# EAGLE board FA_IOTv4.2.1 (EAGLE 7.2.0)
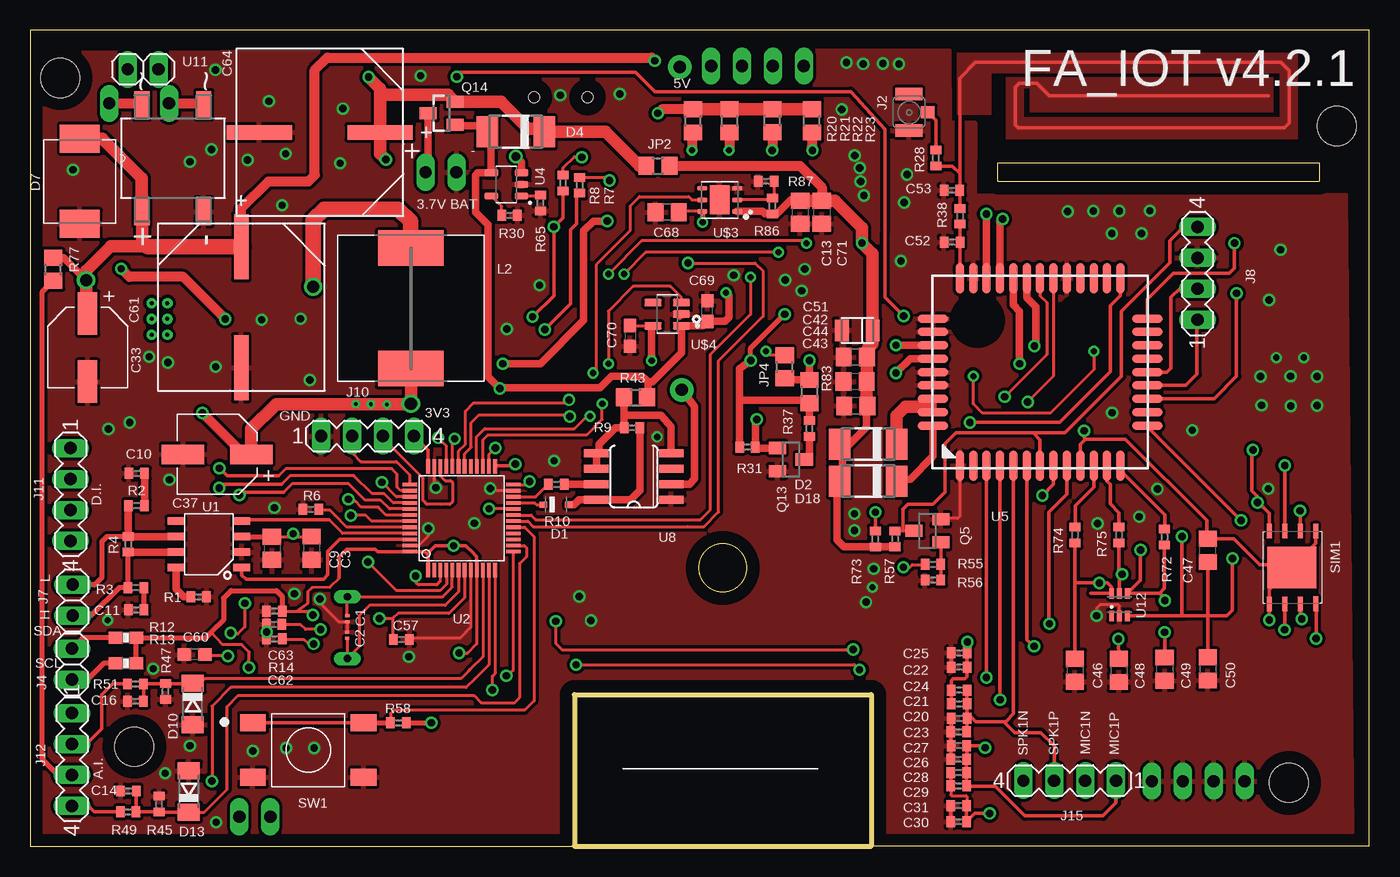
[diagram p6: board, top side]
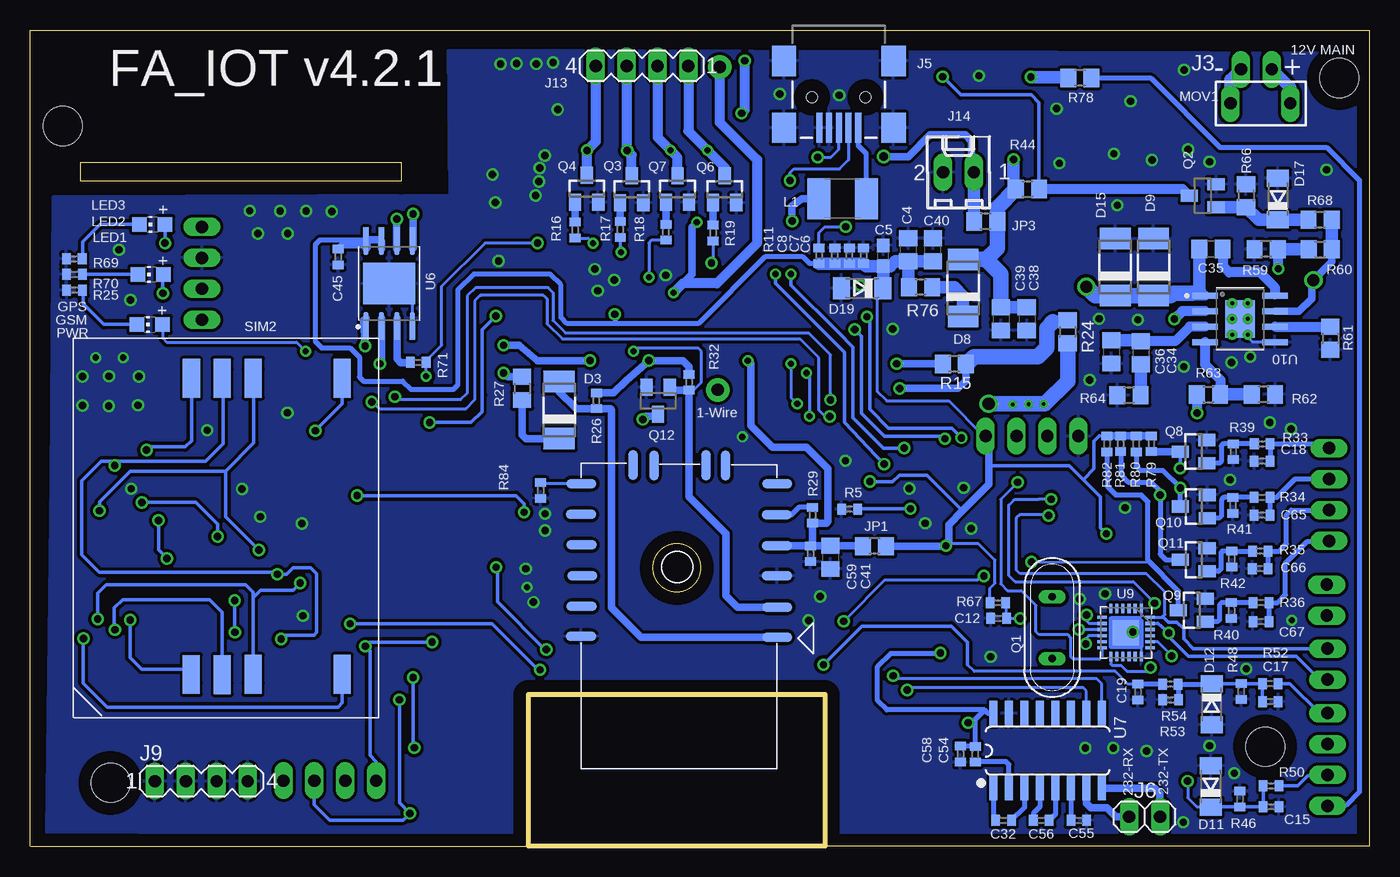
[diagram p7: board, bottom side, seen from below]

Size 110 x 67 mm. Coordinates in mm from the lower left corner, seen from the top.
Outline: 110,0 110,67 0,67 0,0 44.7,0
Outline: 44.7,0 69.09,0
Outline: 44.7,0 44.7,12.45 69.09,12.45 69.09,0
Outline: 109.98,0 69.09,0
Outline: 79.5,56.13 105.92,56.13 105.92,54.61 79.5,54.61 79.5,56.13
Outline: circle at 56.89,22.86 radius 1.96
Copper layers (1*16): Top 0.035mm / dielectric 1.5mm / Bottom 0.035mm
Design rules "default *": minimum track width 8mil, minimum drill 0.3mm, track to track 8mil, track to pad 8mil, pad to pad 8mil, via to via 8mil, smd to smd 8mil, copper to edge 40mil, drill to drill 8mil, minimum pad ring 10mil, minimum via ring 8mil, stop-mask expansion 4mil, vias tented up to drill 25mil, thermal gap 10mil
Net classes: 1 POWER: clearance 0.205 mm; 2 GND: clearance 0.205 mm; 3 CAN: width 0.254 mm, clearance 0.205 mm
Holes 3.2 mm at 107.35,59.15 103.41,5.19 2.45,63.09 8.54,8.17

## Footprints (pad centres in the part's own frame; a part is rotated, then mirrored left to right if it is on the bottom)
C0201 = smd 0.25 x 0.35: 1 -0.25,0; 2 0.25,0
C0805 = smd 1.3 x 1.5: 1 -0.95,0; 2 0.95,0
C0603 = smd 1.1 x 1: 1 -0.85,0; 2 0.85,0
C0402 = smd 0.7 x 0.9: 1 -0.65,0; 2 0.65,0
3.5X1.6X2.1(BXCXA) = smd 3.5 x 1.6: 1 2.8,0; 2 -2.8,0
TE-A-3216 = smd 1.143 x 1.778: + 1.27,0; - -1.27,0
SM_RADIAL_H13 = smd 5.359 x 1.194: 1 -4.966,0; 2 4.966,0
SOD2513X120N = smd 0.6 x 0.5: A 1.05,0; C -1.05,0
DO-214AC = smd 1.778 x 2.54: A 2.342,0; C -2.342,0
S1M_DO-214AC = smd 1.778 x 2.54: A 2.342,0; C -2.342,0
VARTVSP_SMC&SMD/DO-214AB = smd 2.3 x 3.3: 1 -3.5,0; 2 3.5,0
SOD80C = smd 1.4 x 1.8: A 1.7,0; C -1.7,0
FOOT = drill 1 pad 1.93: 1 0.02,-0.01
CON-U.FL = smd 1 x 2.2: GND@0 -1.5,0; GND@1 1.5,0 | smd 1 x 1.1: S 0,-1.55
1X02 = drill 1.016 long: 1 -1.27,0; 2 1.27,0
USB-MINIB = smd 2.5 x 0.5: D+ 2.5,0; D- 2.5,0.8; GND 2.5,-1.6; ID 2.5,-0.8; VBUS 2.5,1.6 | smd 2.5 x 2: S1 -3,4.5; S2 2.5,4.5; S3 -3,-4.5; S4 2.5,-4.5 | hole 0.9: 0,2.2; 0,-2.2
MA04-1 = drill 1.016 long: 1 -3.81,0; 2 -1.27,0; 3 1.27,0; 4 3.81,0
6410-02 = drill 1.016 long: 1 1.27,0; 2 -1.27,0
R0805 = smd 1.3 x 1.5: 1 -0.95,0; 2 0.95,0
L1812 = smd 1.9 x 3.4: 1 -1.95,0; 2 1.95,0
WE-PD_1260/1245/1280/1210 = smd 2.9 x 5.4: 1 -4.95,0; 2 4.95,0
CHIP-LED0805 = smd 1.2 x 1.2: A 0,-1.05; C 0,1.05
TMOV14R275E = drill 1.016 long: 1 -2.495,0.11; 2 2.43,0.107
QS = drill 0.61 long: 1 -2.54,0; 2 2.54,0
SOT23 = smd 1 x 1.4: 1 -0.95,-1.1; 2 0.95,-1.1; 3 0,1.1
SOT23-BEC = smd 1 x 1.4: B -0.95,-1.1; C 0,1.1; E 0.95,-1.1
SSOT-3 = smd 1 x 1.4: 1 -0.95,-1.1; 2 0.95,-1.1; 3 0,1.1
R0402 = smd 0.7 x 0.9: 1 -0.65,0; 2 0.65,0
0603-RES = smd 1.1 x 1: 1 -0.85,0; 2 0.85,0
MFF2DFN8 = smd 0.6 x 0.4: 1 -2.696,1.848; 2 -2.696,0.578; 3 -2.696,-0.692; 4 -2.696,-1.962; 5 2.684,-1.962; 6 2.684,-0.692; 7 2.684,0.578; 8 2.684,1.848 | smd 1.2 x 0.4: C 2.987,1.848; D 2.98,0.583; E 2.985,-0.686; F 2.974,-1.958; G -2.992,-1.957; H -2.998,-0.692; I -2.998,0.58; J -2.999,1.847 | smd 3.4 x 4: PAD 0,0
91228-3001 = smd 3.2 x 1.4: C 22.62,-0.006; D 22.623,-2.534; E 22.633,-5.089; F 22.637,-12.401; G -1.698,-12.398; H -1.706,-5.067; I -1.717,-2.547; J -1.711,0 | smd 2.3 x 1.4: C1 22.175,0; C2 22.175,-2.54; C3 22.175,-5.08; C4 22.175,-12.4; C5 -1.27,0; C6 -1.27,-2.54; C7 -1.27,-5.08; C8 -1.27,-12.4
SW_5-1437565-0 = smd 2.1 x 1.4: 1 -4.55,2.25; 2 4.55,2.25; 3 -4.55,-2.25; 4 4.55,-2.25
SOIC8-6.0 = smd 0.6 x 1.4: 1 -1.905,-2.7; 2 -0.635,-2.7; 3 0.635,-2.7; 4 1.905,-2.7; 5 1.905,2.7; 6 0.635,2.7; 7 -0.635,2.7; 8 -1.905,2.7
LQFP48 = smd 0.3 x 1.2: 1 -2.75,-4.25; 2 -2.25,-4.25; 3 -1.75,-4.25; 4 -1.25,-4.25; 5 -0.75,-4.25; 6 -0.25,-4.25; 7 0.25,-4.25; 8 0.75,-4.25; 9 1.25,-4.25; 10 1.75,-4.25; 11 2.25,-4.25; 12 2.75,-4.25; 25 2.75,4.25; 26 2.25,4.25; 27 1.75,4.25; 28 1.25,4.25; 29 0.75,4.25; 30 0.25,4.25; 31 -0.25,4.25; 32 -0.75,4.25; 33 -1.25,4.25; 34 -1.75,4.25; 35 -2.25,4.25; 36 -2.75,4.25 | smd 1.2 x 0.3: 13 4.25,-2.75; 14 4.25,-2.25; 15 4.25,-1.75; 16 4.25,-1.25; 17 4.25,-0.75; 18 4.25,-0.25; 19 4.25,0.25; 20 4.25,0.75; 21 4.25,1.25; 22 4.25,1.75; 23 4.25,2.25; 24 4.25,2.75; 37 -4.25,2.75; 38 -4.25,2.25; 39 -4.25,1.75; 40 -4.25,1.25; 41 -4.25,0.75; 42 -4.25,0.25; 43 -4.25,-0.25; 44 -4.25,-0.75; 45 -4.25,-1.25; 46 -4.25,-1.75; 47 -4.25,-2.25; 48 -4.25,-2.75
SOT95P280X110-5N = smd 1.14 x 0.59: 1 -1.245,0.95; 2 -1.245,0; 3 -1.245,-0.95; 4 1.245,-0.95; 5 1.245,0.95
M66 = smd 2.5 x 0.7: 1 -7.7,6.6; 2 -7.7,5.5; 3 -7.7,4.4; 4 -7.7,3.3; 5 -7.7,2.2; 6 -7.7,1.1; 7 -7.7,0; 8 -7.7,-1.1; 9 -7.7,-2.2; 10 -7.7,-3.3; 11 -7.7,-4.4; 12 -7.7,-5.5; 13 -7.7,-6.6; 23 7.7,-6.6; 24 7.7,-5.5; 25 7.7,-4.4; 26 7.7,-3.3; 27 7.7,-2.2; 28 7.7,-1.1; 29 7.7,0; 30 7.7,1.1; 31 7.7,2.2; 32 7.7,3.3; 33 7.7,4.4; 34 7.7,5.5; 35 7.7,6.6 | smd 0.7 x 2.5: 14 -4.4,-8.8; 15 -3.3,-8.8; 16 -2.2,-8.8; 17 -1.1,-8.8; 18 0,-8.8; 19 1.1,-8.8; 20 2.2,-8.8; 21 3.3,-8.8; 22 4.4,-8.8; 36 4.4,8.8; 37 3.3,8.8; 38 2.2,8.8; 39 1.1,8.8; 40 0,8.8; 41 -1.1,8.8; 42 -2.2,8.8; 43 -3.3,8.8; 44 -4.4,8.8
SON127P600X500X80-9N = smd 1.04 x 0.44: 1 -2.845,1.905; 2 -2.845,0.635; 3 -2.845,-0.635; 4 -2.845,-1.905; 5 2.845,-1.905; 6 2.845,-0.635; 7 2.845,0.635; 8 2.845,1.905 | smd 3.4 x 4.3: 9 0,0 | smd 1.5 x 0.45: C 3.865,1.905; D 3.881,0.636; E 3.873,-0.636; F 3.859,-1.912; G -3.868,1.913; H -3.862,0.643; I -3.864,-0.645; J -3.869,-1.899
SOIC16-1.27-10X3.9MM = smd 0.66 x 2.032: 1 -4.445,-3.073; 2 -3.175,-3.073; 3 -1.905,-3.073; 4 -0.635,-3.073; 5 0.635,-3.073; 6 1.905,-3.073; 7 3.175,-3.073; 8 4.445,-3.073; 9 4.445,3.073; 10 3.175,3.073; 11 1.905,3.073; 12 0.635,3.073; 13 -0.635,3.073; 14 -1.905,3.073; 15 -3.175,3.073; 16 -4.445,3.073
SO08 = smd 0.66 x 2.032: 1 -1.905,-3.073; 2 -0.635,-3.073; 3 0.635,-3.073; 4 1.905,-3.073; 5 1.905,3.073; 6 0.635,3.073; 7 -0.635,3.073; 8 -1.905,3.073
QFN50P400X400X95-25T265X275N = smd 0.26 x 0.79: 1 -1.25,-1.97; 2 -0.75,-1.97; 3 -0.25,-1.97; 4 0.25,-1.97; 5 0.75,-1.97; 6 1.25,-1.97; 13 1.25,1.97; 14 0.75,1.97; 15 0.25,1.97; 16 -0.25,1.97; 17 -0.75,1.97; 18 -1.25,1.97 | smd 0.79 x 0.26: 7 1.97,-1.25; 8 1.97,-0.75; 9 1.97,-0.25; 10 1.97,0.25; 11 1.97,0.75; 12 1.97,1.25; 19 -1.97,1.25; 20 -1.97,0.75; 21 -1.97,0.25; 22 -1.97,-0.25; 23 -1.97,-0.75; 24 -1.97,-1.25 | smd 2.15 x 2.05: 25 0,0
SOIC127P600X170-9N = smd 2.2 x 0.5: 1 -2.875,1.905; 2 -2.875,0.635; 3 -2.875,-0.635; 4 -2.875,-1.905; 5 2.875,-1.905; 6 2.875,-0.635; 7 2.875,0.635; 8 2.875,1.905 | smd 2.4 x 3.1: 9 0,0 | drill 0.33 pad 0.5: 9.1 -0.65,0; 9.2 0.65,0; 9.3 -0.65,1.3; 9.4 -0.65,-1.3; 9.5 0.65,1.3; 9.6 0.65,-1.3
SOT508P985X260-4N = smd 2.235 x 1.245: 1 -4.394,2.54; 2 -4.394,-2.54; 3 4.394,-2.54; 4 4.394,2.54
WE-TVS_SC70-6L = smd 0.4 x 0.85: 1 -0.65,-0.925; 2 0,-0.925; 3 0.65,-0.925; 4 0.65,0.925; 5 0,0.925; 6 -0.65,0.925
L89 = smd 2.5 x 0.8: 1 -8.2,3.212; 2 -8.213,0.738; 3 -8.193,-1.838; 4 -8.19,-4.309; 5 -8.17,-6.858; 6 -8.197,-9.387; 7 7.892,-9.411; 8 7.91,-6.876; 9 7.876,-4.371; 10 7.818,-1.829; 11 7.876,0.676; 12 7.905,3.133 | smd 0.8 x 2.5: 13 -3.975,-10.898; 14 -2.342,-10.912; 15 1.924,-10.892; 16 3.624,-10.923
SON95P300X300X100-7N = smd 0.84 x 0.4: 1 -1.435,0.95; 2 -1.435,0; 3 -1.435,-0.95; 4 1.435,-0.95; 5 1.435,0; 6 1.435,0.95 | smd 1.625 x 2.365: 7 0,0
SOT95P280X145-5N = smd 1.39 x 0.6: 1 -1.165,0.95; 2 -1.165,0; 3 -1.165,-0.95; 4 1.165,-0.95; 5 1.165,0.95

## Placement (x,y rotation side)
C1  22pF  [C0201]  26.04,18.68 90 top
C2  22pF  [C0201]  26.03,17.31 270 top
C3  VJ0805Y103MXXCW1BC  [C0805]  23.11,24.48 270 top
C4  10uF  [C0805]  37.87,48.99 90 bottom
C5  1uF  [C0603]  39.92,48.49 90 bottom
C6  0.1uF  [C0402]  41.54,48.49 90 bottom
C7  0.1uF  [C0402]  42.7,48.49 90 bottom
C8  0.1uF  [C0402]  43.9,48.49 90 bottom
C9  0.1uF  [C0805]  19.85,24.47 270 top
C10  560pF  [C0402]  8.73,30.62 180 top
C11  560pF  [C0402]  8.7,19.41 180 top
C12  0.1uF  [C0402]  30.43,18.71 180 bottom
C13  10uf  [C0805]  63.25,52.07 270 top
C14  0.1uF  [C0402]  8.06,4.53 180 top
C15  0.1uF  [C0402]  8.05,3.23 0 bottom
C16  0.1uF  [C0402]  8.64,11.9 180 top
C17  0.1uF  [C0402]  8.11,11.87 0 bottom
C18  0.1uF  [C0402]  8.79,31.62 180 bottom
C19  0.1uF  [C0402]  18.99,12.66 270 bottom
C20  33pF  [C0402]  76.31,10.5 0 top
C21  33pF  [C0402]  76.31,11.69 180 top
C22  33pF  [C0402]  76.32,14.71 180 top
C23  10pF  [C0402]  76.28,9.39 0 top
C24  10pF  [C0402]  76.31,12.81 180 top
C25  10pF  [C0402]  76.32,15.86 180 top
C26  10pF  [C0402]  76.27,7.13 0 top
C27  33pF  [C0402]  76.29,8.25 0 top
C28  10pF  [C0402]  76.28,6.04 180 top
C29  33pF  [C0402]  76.28,4.94 180 top
C30  10pF  [C0402]  76.28,2 180 top
C31  33pF  [C0402]  76.28,3.32 180 top
C32  0.1uF  [C0402]  30.02,2.1 0 bottom
C33  4.7uF 100V  [3.5X1.6X2.1(BXCXA)]  4.7,40.96 90 top
C34  330pF  [C0805]  18.75,40.53 270 bottom
C35  0.1uF  [C0805]  13,49.05 0 bottom
C36  NM  [C0805]  21.18,40.59 270 bottom
C37  33uF 16V  [3.5X1.6X2.1(BXCXA)]  15.35,32.18 0 top
C38  10uF  [C0805]  28.13,43.3 270 bottom
C39  0.1uF  [C0805]  30.25,43.3 270 bottom
C40  10uF  [C0805]  35.83,48.99 90 bottom
C41  10uF  [C0805]  44.26,23.72 270 bottom
C42  100nF  [C0805]  67.78,40.17 180 top
C43  10pF  [C0805]  67.82,36.15 180 top
C44  33pF  [C0805]  67.76,38.15 180 top
C45  0.1uF  [C0402]  84.71,48.4 270 bottom
C46  33pF  [C0805]  85.82,14.45 270 top
C47  0.1uF  [C0805]  96.74,24.28 90 top
C48  33pF  [C0805]  89.44,14.43 270 top
C49  33pF  [C0805]  93.2,14.54 270 top
C50  33pF  [C0805]  96.74,14.55 270 top
C51  TCTAL1A476M8R  [TE-A-3216]  67.94,42.36 0 top
C52  NM  [C0402]  75.73,49.61 180 top
C53  NM  [C0402]  75.72,53.87 180 top
C54  0.1uF  [C0402]  32.36,7.54 270 bottom
C55  0.1uF  [C0402]  23.84,2.12 0 bottom
C56  0.1uF  [C0402]  26.93,2.11 0 bottom
C57  NM  [C0402]  30.49,16.97 0 top
C58  0.1uF  [C0402]  33.57,7.56 270 bottom
C59  0.1uF  [C0402]  45.88,24.01 270 bottom
C60  1uF  [C0603]  13.49,15.74 180 top
C61  EEV-FK2A470Q  [SM_RADIAL_H13]  17.32,44.26 270 top
C62  0.1uF  [C0402]  20.05,17.02 180 top
C63  0.1uF  [C0402]  20.05,19.3 180 top
C64  1000uf/16v  [SM_RADIAL_H13]  23.77,58.63 180 top
C65  0.1uF  [C0402]  8.8,27.18 180 bottom
C66  0.1uF  [C0402]  8.95,22.8 180 bottom
C67  0.1uF  [C0402]  8.89,18.45 180 bottom
C68  10uf  [C0805]  52.32,52.07 180 top
C69  1uf  [C0603]  55.63,43.94 90 top
C70  1uf  [C0603]  49.28,41.91 270 top
C71  10uf  [C0805]  65.02,52.07 270 top
D1  1N4148WS-7-F  [SOD2513X120N]  43.19,28.05 0 top
D2  SS110  [DO-214AC]  68.83,33.02 180 top
D3  SS110  [DO-214AC]  66.55,35.81 90 bottom
D4  S1M_S1M  [S1M_DO-214AC]  39.88,58.67 180 top
D7  [VARTVSP_SMC&SMD/DO-214AB]  4.06,54.61 90 top
D8  S1M  [DO-214AC]  33.36,45.85 90 bottom
D9  SS110  [DO-214AC]  17.71,47.56 90 bottom
D10  TZMC3V3-GS08  [SOD80C]  13.35,11.69 270 top
D11  TZMC3V3-GS08  [SOD80C]  13.02,4.9 90 bottom
D12  TZMC3V3-GS08  [SOD80C]  12.93,11.65 270 bottom
D13  TZMC3V3-GS08  [SOD80C]  13.01,4.49 90 top
D15  SS110  [DO-214AC]  20.86,47.56 90 bottom
D17  TZMC3V3-GS08  [SOD80C]  7.49,53.14 90 bottom
D18  SS110  [DO-214AC]  68.83,29.98 180 top
D19  TZMC3V3-GS08  [SOD80C]  41.66,45.83 180 bottom
J1  FOOT  [FOOT]  53.5,37.47 180 bottom
J2  CON-HIROSE-COAXIAL-U.FL  [CON-U.FL]  72.19,60.27 90 top
J3  [1X02]  9.26,63.81 0 top
J4  [1X02]  3.42,14.95 90 top
J5  USB_MINI-B_SMT  [USB-MINIB]  43.58,61.5 270 bottom
J6  [1X02]  18.44,2.41 180 bottom
J7  [1X02]  3.48,20.21 90 top
J8  [MA04-1]  95.91,47.05 90 top
J9  [MA04-1]  95.96,5.33 0 bottom
J10  [MA04-1]  27.7,33.68 0 top
J11  [MA04-1]  3.31,28.88 270 top
J12  [MA04-1]  3.42,7.11 270 top
J13  [MA04-1]  59.74,64.09 180 bottom
J14  Battery  [6410-02]  33.74,55.35 0 bottom
J15  [MA04-1]  85.4,5.37 180 top
J16  FOOT  [FOOT]  53.34,64.01 0 top
JP1  0R  [R0805]  40.64,24.64 180 bottom
JP2  0R  [R0805]  51.56,55.88 0 top
JP3  0R  [R0805]  31.5,51.31 180 bottom
JP4  0R  [R0805]  61.98,39.37 90 top
L1  MF-MSMF050-2 500mA  [L1812]  43.26,53.18 180 bottom
L2  15uH  [WE-PD_1260/1245/1280/1210]  31.26,44.17 90 top
LED1  [CHIP-LED0805]  100.2,42.84 90 bottom
LED2  [CHIP-LED0805]  100.11,46.97 90 bottom
LED3  [CHIP-LED0805]  100,51.07 90 bottom
MOV1  TMOV14R275E  [TMOV14R275E]  8.9,60.91 0 bottom
Q1  8MHz  [QS]  26.04,17.94 270 bottom
Q2  BC547  [SOT23]  13.67,53.42 90 bottom
Q3  PMBT2222A  [SOT23-BEC]  60.59,53.96 0 bottom
Q4  PMBT2222A  [SOT23-BEC]  64.29,53.99 0 bottom
Q5  BC547  [SOT23]  73.71,25.9 90 top
Q6  PMBT2222A  [SOT23-BEC]  52.95,53.97 0 bottom
Q7  PMBT2222A  [SOT23-BEC]  56.83,53.97 0 bottom
Q8  PMBT2222A  [SOT23-BEC]  14.42,32.4 90 bottom
Q9  PMBT2222A  [SOT23-BEC]  14.56,19.37 90 bottom
Q10  PMBT2222A  [SOT23-BEC]  14.41,27.89 90 bottom
Q11  PMBT2222A  [SOT23-BEC]  14.41,23.52 90 bottom
Q12  BC547  [SOT23]  58.42,36.58 180 bottom
Q13  BC547  [SOT23]  62.48,31.75 270 top
Q14  FDN358P  [SSOT-3]  33.78,60.2 90 top
R1  4K7  [R0402]  13.83,20.47 180 top
R2  100R  [R0402]  8.72,27.97 180 top
R3  100R  [R0402]  8.67,21.23 180 top
R4  120R  [R0402]  8.04,24.79 90 top
R5  10K  [R0402]  42.69,27.68 0 bottom
R6  10K  [R0402]  23.04,27.66 180 top
R7  22R  [R0402]  45.13,54.28 90 top
R8  22R  [R0402]  43.77,54.46 90 top
R9  4K7  [R0402]  49.44,34.37 180 top
R10  4K7  [R0402]  43.2,29.72 180 top
R11  1K5  [R0402]  45.2,48.49 90 bottom
R12  10K  [0603-RES]  7.85,17.11 0 top
R13  10K  [0603-RES]  7.85,15.02 0 top
R14  4K7  [R0402]  20.02,18.21 180 top
R15  NM  [R0805]  34.08,39.6 180 bottom
R16  1K2  [R0402]  65.23,50.6 90 bottom
R17  1K2  [R0402]  61.53,50.64 90 bottom
R18  1K2  [R0402]  57.78,50.42 90 bottom
R19  1K2  [R0402]  53.9,50.37 90 bottom
R20  10K  [R0805]  54.45,59.57 90 top
R21  10K  [R0805]  57.45,59.57 90 top
R22  10K  [R0805]  60.97,59.59 90 top
R23  10K  [R0805]  64.21,59.56 90 top
R24  0R  [R0805]  24.78,42.24 270 bottom
R25  4k7  [R0402]  106.37,45.67 180 bottom
R26  10K  [R0402]  63.5,36.58 270 bottom
R27  0R  [R0805]  69.6,37.59 270 bottom
R28  0R  [R0402]  74.39,56.51 90 top
R29  1K  [R0402]  45.72,27.18 270 bottom
R30  2k  [R0402]  39.37,51.82 0 top
R31  10K  [R0402]  58.93,32.77 0 top
R32  10K  [R0402]  55.88,38.1 270 bottom
R33  9K  [R0402]  8.78,33.05 0 bottom
R34  9K  [R0402]  8.81,28.65 0 bottom
R35  9K  [R0402]  8.94,24.23 0 bottom
R36  9K  [R0402]  8.89,20 0 bottom
R37  10K  [R0402]  64.01,34.29 270 top
R38  0R  [R0402]  76.38,51.74 90 top
R39  1K  [R0402]  11.16,32.4 90 bottom
R40  1K  [R0402]  11.3,19.34 90 bottom
R41  1K  [R0402]  11.2,27.99 90 bottom
R42  1K  [R0402]  11.28,23.59 90 bottom
R43  0R  [R0805]  49.72,36.86 0 top
R44  10K  [R0805]  28.06,53.98 0 bottom
R45  1K  [R0402]  10.57,3.46 270 top
R46  1K  [R0402]  10.62,3.87 270 bottom
R47  1K  [R0402]  11.1,12.7 90 top
R48  1K  [R0402]  10.52,12.69 90 bottom
R49  9K  [R0402]  8.04,2.8 180 top
R50  9K  [R0402]  8.05,4.95 0 bottom
R51  9K  [R0402]  8.64,13.31 180 top
R52  9K  [R0402]  8.12,13.35 0 bottom
R53  NM  [R0402]  16.32,12.01 0 bottom
R54  4K7  [R0402]  16.33,13.3 0 bottom
R55  1K2  [R0402]  74.16,23.14 180 top
R56  10K  [R0402]  74.16,21.86 180 top
R57  10K  [R0402]  71.04,25.24 90 top
R58  10K  [R0402]  30.25,10.13 180 top
R59  17.4K  [R0805]  8.46,49.03 180 bottom
R60  100K  [R0805]  4.02,49.02 0 bottom
R61  200K  [R0805]  3.19,41.71 270 bottom
R62  40.2K  [R0805]  8.68,37.1 180 bottom
R63  210K  [R0805]  13.19,37.1 0 bottom
R64  47.5K  [R0805]  19.73,37.04 0 bottom
R65  10k  [R0402]  41.91,52.83 270 top
R66  4K7  [R0805]  10.11,53.42 270 bottom
R67  10K  [R0402]  30.5,19.99 0 bottom
R68  47K  [R0805]  4.02,51.44 180 bottom
R69  4k7  [R0402]  106.39,48.23 0 bottom
R70  4k7  [R0402]  106.39,46.96 0 bottom
R71  4K7  [R0402]  78.14,39.74 0 bottom
R72  22R  [R0402]  93.19,25.39 270 top
R73  4K7  [R0402]  69.42,25.23 270 top
R74  22R  [R0402]  85.84,25.56 270 top
R75  22R  [R0402]  89.46,25.55 270 top
R76  10K  [R0805]  36.85,45.9 180 bottom
R77  NM  [R0805]  1.87,47.38 90 top
R78  NM  [R0805]  23.76,63.1 180 bottom
R79  4K7  [R0402]  17.89,33.05 270 bottom
R80  4K7  [R0402]  19.14,33.04 270 bottom
R81  4K7  [R0402]  20.42,33.05 270 bottom
R82  4K7  [R0402]  21.54,33.03 270 bottom
R83  0R  [R0805]  64.01,37.34 270 top
R84  4.7k  [R0402]  68.07,29.21 270 bottom
R86  9k1  [R0402]  60.96,52.58 90 top
R87  1k2  [R0402]  60.45,54.61 180 top
SIM1  MFF2_SIM  [MFF2DFN8]  103.65,22.89 90 top
SIM2  912283001  [91228-3001]  96.78,15.81 90 bottom
SW1  5-1437565-0  [SW_5-1437565-0]  22.83,7.89 0 top
U1  MCP2551-SOIC8  [SOIC8-6.0]  14.66,24.79 90 top
U2  STM32F103C8T  [LQFP48]  35.43,26.94 0 top
U4  STC4054GR  [SOT95P280X110-5N]  39.12,54.36 180 top
U5  M66  [M66]  82.97,38.94 90 top
U6  W25Q32FVZPIG_TR  [SON127P600X500X80-9N]  80.52,46.21 90 bottom
U7  DRIVER-MAX3232ECDR(SOIC16)  [SOIC16-1.27-10X3.9MM]  26.41,7.84 0 bottom
U8  DS2480B  [SO08]  49.58,30.35 90 top
U9  MPU6050  [QFN50P400X400X95-25T265X275N]  19.98,17.54 180 bottom
U10  MP4559DN  [SOIC127P600X170-9N]  10.61,43.3 0 bottom
U11  DF10S  [SOT508P985X260-4N]  11.71,56.5 90 top
U12  TVS_82402375  [WE-TVS_SC70-6L]  89.49,19.84 0 top
U$1  L89  [L89]  56.84,20.37 180 bottom
U$3  LD39200PU33R  [SON95P300X300X100-7N]  56.64,53.09 180 top
U$4  LDK220M33R  [SOT95P280X145-5N]  52.32,43.69 180 top

## Tracks (layer width: path | path; a pad name or v marks a point on that pad's centre or on a via)
1_WIRE
  Top 0.61: U8.2 54.17,29.72 54.59,30.15 54.59,36.08 J1.1
4.2V  (via drill 0.6)
  Top 0.61: Q14.2 34.61,61.15
  Top 1.016: v27.8,63.17 28.74,62.23 28.74,61.7 | 28.74,61.7 C64.1 28.74,56.86 v29.21,56.39 | JP2.1 50.04,55.88 47.24,58.67 D4.C 41.97,58.93 40.89,58.93 38.67,61.15 Q14.2 34.33,61.7 28.74,61.7
  Bottom 1.016: D8.A | C38.1 C39.1 | v27.8,63.17 24.78,63.17 R78.2 | v29.21,56.39 29.21,54.18 R44.1
  Bottom 1.27: 31.47,48.19 30.55,49.11 JP3.1 30.55,52.45 R44.1 | 31.47,48.19 D8.A | C39.1 30.25,46.97 31.47,48.19
5V  (via drill 0.5, 0.6)
  Top 0.254: 50.29,38.61 50.28,38.6 | U$3.6 53.34,52.14 C68.1
  Top 0.305: 50.18,38.7 50.28,38.6 50.53,38.34 | 50.73,36.92 R43.2
  Top 0.406: U$3.6 55.21,51.27 v55.24,51.23
  Top 0.61: v57.15,45.47 57.4,45.21 57.4,43.43 57.06,43.09 C69.1 55.27,42.74 U$4.1 53.49,40.53 51.1,38.15 50.73,38.15 | 50.73,36.92 50.73,38.15 | 50.73,38.15 50.53,38.34 50.27,38.61 47.75,38.61 46.81,37.67 38.64,37.67 v38.56,37.59 37.59,38.57 37.59,51.05 36.58,52.07 36.58,55.12 36.76,55.31 U4.4 37.87,58.34 D4.A | Q14.1 34.95,59.18 37.03,59.18 D4.A | 37.87,58.5 D4.A
  Bottom 0.305: 38.68,37.6 v38.56,37.59
  Bottom 0.61: v57.15,45.47 55.63,46.99 55.63,50.85 v55.24,51.23 | R15.1 33.13,38.24 33.78,37.59 v38.56,37.59
  Bottom 0.813: J16.1 53.36,59.46 50.29,56.39 50.29,49.53 53.59,46.23 56.39,46.23 v57.15,45.47
  Bottom 1.016: R15.1 33.02,39.65 | 26.46,42.55 26.2,42.81 26.2,42.86 | 26,43.06 24.91,43.06 R24.1
  Bottom 1.27: 33.02,39.65 32.48,40.19 27.21,40.19 26.46,40.94 26.46,42.55 | 26.2,42.86 26,43.06
+5V  (via drill 0.3, 0.6, 1)
  Top 0.406: v29.28,36.28 28.5,36.28 28.47,36.31 | v27.98,36.29 28.52,36.29 28.55,36.31 | v26.75,36.31 v26.74,36.31
  Top 0.813: v14.14,35.58 14.1,35.55 14.15,35.55 17.48,32.23 18.1,32.23 C37.1
  Top 1.016: L2.1 31.26,36.34 v31.25,36.33 31.24,36.31 28.55,36.31 28.47,36.31 v26.74,36.31 20.19,36.31 20.05,36.17 18.15,34.27 C37.1
  Bottom 0.813: R63.1 v14.14,35.58
  Bottom 1.016: 24.75,41.26 R24.2
  Bottom 1.27: v31.25,36.33 26.62,36.33 24.75,38.2 24.75,41.26
+12V  (via drill 0.6, 1)
  Top 0.61: R77.2 2.73,48.33 v4.57,46.48
  Top 0.813: C61.1 17.32,52.37 19.56,54.61 22.86,54.61 23.37,55.12 23.37,63.75 24.38,64.77 51.05,64.77 v51.31,64.52 | 51.63,60.27 v51.56,60.2 51.89,60.52 R20.2
  Top 1.016: 4.74,44.31 C33.1 4.57,43.89 v4.57,46.48 4.57,47.24 6.6,49.28 9.4,49.28 9.5,49.38 | D7.2 5.9,58.11 9.14,54.86 9.14,52.13 U11.1 9.17,49.71 9.5,49.38 | 9.5,49.38 9.65,49.23 | R20.2 R21.2 60.95,60.52 R22.2 64.19,60.54 R23.2
  Top 1.27: C61.1 9.65,49.23
  Bottom 0.61: U10.7 5.76,43.94 4.72,44.97 4.72,46.33 v4.57,46.48 3.05,48.01 3.05,49
  Bottom 0.813: v51.31,64.52 51.31,60.45 v51.56,60.2
  Bottom 1.016: R60.2 R68.1
  Bottom 1.27: 3.05,49 R60.2
AI1
  Bottom 0.305: R52.2 6.51,13.35 4.06,10.89 3.45,10.89 J12.1
AI2
  Top 0.305: R51.2 6.74,13.31 5.84,12.41 5.84,9.65 4.57,8.38 J12.2
AI3
  Top 0.406: J12.3 3.41,5.85 2.26,5.85 0.98,7.13 0.98,45.54 R77.1
  Bottom 0.305: R50.2 5.86,4.95 5.03,5.78 3.48,5.78 J12.3
AI4
  Top 0.305: R49.2 5.25,2.8 4.73,3.32 3.44,3.32 J12.4
  Bottom 0.406: R78.1 17.95,63.1 12.25,57.4 3.49,57.4 0.8,54.7 0.8,4.45 1.88,3.37 3.35,3.37 J12.4
AIN0
  Top 0.254: U2.10 37.18,15.55 36.14,14.51 36.05,14.42 36,14.37 35.99,14.37 35.38,13.75 14.32,13.75 13.88,13.31 13.42,13.31 D10.C
  Top 0.305: C16.1 R51.1 11.07,13.31 R47.2 13.31,13.35 D10.C
AIN1  (via drill 0.6)
  Top 0.254: U2.11 37.68,14.91 36.53,13.76 36.52,13.76 35.8,13.04 16.46,13.04 14.91,11.5 14.91,5.35 v14.9,5.34
  Bottom 0.254: v14.9,5.34 14.9,3.98 14.14,3.22 13.03,3.22 D11.C
  Bottom 0.305: R50.1 C15.1 10.61,3.23 R46.2 13,3.22 D11.C
AIN4
  Top 0.254: D13.C 14.3,2.79 16.15,4.65 16.15,11.45 17.09,12.38 36.45,12.38 37.03,11.79 39.8,11.79 40.19,12.19 40.18,12.2 40.18,23.2 40.77,23.78 40.77,24.51 40.59,24.69 U2.14
  Top 0.305: D13.C 10.59,2.79 R45.2 8.69,2.81 R49.1 8.69,4.5 C14.1
CANH
  Top 0.406: R4.1 8.02,24.12 R3.2 7.28,21.23 5,18.94 J7.1
  Top 0.61: U1.7 8.05,24.16 R4.1
CANL
  Top 0.406: 8.05,25.43 6.29,25.43 5.87,25 5.87,22.05 5.27,21.46 3.5,21.46 J7.2
  Top 0.61: R2.2 8.04,27.93 R4.2 8.05,25.43 U1.6
CANRX
  Top 0.254: U2.45 25.65,25.69 24.54,26.79
  Top 0.305: 24.54,26.79 17.46,26.79 U1.4
CANTX
  Top 0.305: U2.46 25.41,25.19 24.44,24.23 24.44,22.28 24.08,21.91 17.71,21.91 17.37,22.26 U1.1
  Top 0.406: U1.1 17.62,22.89 17.66,22.85
CS_SF  (via drill 0.6)
  Top 0.61: U5.30 81.87,45.05 82.6,44.31 82.6,41.14 v82.5,41.07
  Bottom 0.61: v82.5,41.07 82.61,43.18 U6.1
DI1  (via drill 0.6)
  Top 0.254: U2.38 30.43,29.19 30.14,29.48 30.14,30.54 29.68,31 20.98,31 20.39,30.41
  Top 0.305: 20.39,30.41 16.16,30.41 v15.52,31.04
  Bottom 0.305: v15.52,31.04 Q8.C
  Bottom 0.61: Q8.C R79.2
DI2  (via drill 0.6)
  Top 0.254: U2.40 29.8,28.19 29.05,28.95 28.06,28.95 26.57,30.44 21.36,30.44 20.66,29.73
  Top 0.305: 20.66,29.73 15.82,29.73 v15.51,29.42
  Bottom 0.406: Q10.C v15.51,29.42 16.93,30.85 18.8,30.85 19.14,31.19 R80.2
DI3  (via drill 0.6)
  Top 0.254: U2.41 29.51,27.69 28.77,28.42 27.5,28.42 26.16,29.76 21.5,29.76 20.8,29.05
  Top 0.305: 20.8,29.05 17.4,29.05 v17.17,28.83
  Bottom 0.406: Q11.C 15.53,23.51 16.7,23.51 17.17,23.98 v17.17,28.83 17.17,29.19 17.89,29.91 19.81,29.91 20.42,30.51 R81.2
DI6  (via drill 0.6)
  Top 0.254: U2.4 34.18,21.5 33.66,20.98 30.09,20.98 v27.74,23.33
  Bottom 0.254: v27.74,23.33 18.3,23.34 18.18,23.47
  Bottom 0.406: Q9.C 15.66,20.95 18.18,23.47 18.18,28.3 18.71,28.84 20.78,28.84 21.49,29.55 R82.2
DIV1
  Bottom 0.406: C18.1 R33.2 3.66,33.05 J11.1
DIV2
  Bottom 0.406: C65.1 R34.2 7.59,28.65 6.08,30.16 3.32,30.16 J11.2
DIV3
  Bottom 0.406: C66.1 R35.2 7.39,24.23 6.8,24.82 6.8,27.21 6.41,27.6 J11.3
DIV4
  Bottom 0.406: C67.1 R36.2 7.52,20 6.88,20.64 6.88,23.23 5.08,25.04 3.33,25.04 J11.4
DO1  (via drill 0.6)
  Top 0.254: U2.18 40.88,26.69 41.32,26.25 54.02,26.25 55.37,26.25 56.56,27.45 56.56,39.88 60.2,43.52 60.2,47.24 59.55,47.89 v54.03,47.89
  Bottom 0.254: R19.1 53.9,48.02 v54.03,47.89
DO2  (via drill 0.5)
  Top 0.254: U2.19 41.14,27.19 41.52,26.82 55.05,26.82 55.88,27.65 55.88,40.39 59.18,43.69 v59.18,46.74
  Bottom 0.254: R18.1 58.94,49.77 59.18,49.53 v59.18,46.74
DO3  (via drill 0.5, 0.6)
  Top 0.254: v61.47,48.77 50.55,48.77 v48.77,46.99
  Top 0.305: U2.25 38.18,31.22 39.7,31.22 v39.85,31.37
  Bottom 0.254: R17.1 61.53,48.83 v61.47,48.77
  Bottom 0.305: v39.85,31.37 43.1,34.83 43.1,40.57 48.77,46.24 v48.77,46.99
DO4  (via drill 0.5, 0.6)
  Top 0.254: U2.26 37.68,32.17 v38.2,32.69 | v47.5,46.99 50.22,49.71 63.58,49.71 v63.75,49.53
  Bottom 0.254: 43.62,42.21 | R16.1 64.17,49.95 v63.75,49.53
  Bottom 0.305: v38.2,32.69 39.91,32.69 42.39,35.17 42.39,40.98 43.62,42.21 47.5,46.09 v47.5,46.99
DOV1  (via drill 0.5)
  Top 0.813: R20.1 54.36,58.53 v54.36,57.15
  Bottom 0.813: Q6.C 52.95,55.74 v54.36,57.15 55.93,58.72 J13.1
DOV2  (via drill 0.5)
  Top 0.813: 57.4,58.58 R21.1 57.45,57.19 v57.4,57.15
  Bottom 0.813: Q7.C 56.83,56.58 v57.4,57.15 58.47,58.22 J13.2
DOV3  (via drill 0.6)
  Top 0.813: R22.1 60.97,57.41 v60.96,57.15
  Bottom 0.813: J13.3 61.01,57.2 v60.96,57.15 60.59,56.78 Q3.C
DOV4  (via drill 0.6)
  Top 0.813: R23.1 64.21,57.45 v64.26,57.15
  Bottom 0.813: Q4.C 64.26,55.12 v64.26,57.15 63.55,57.86 J13.4
FB4
  Bottom 0.305: D12.C R48.2 10.51,13.35 R52.1 C17.1
  Bottom 0.406: D12.C 12.98,13.3 R54.2 15.68,12.02 R53.2
GND  (via drill 0.5, 0.6)
  Top 0.254: U2.23 37.97,29.19 v37.78,29.38 | U2.8 36.18,22.36 36.19,22.35 36.19,17.96 35.31,17.08 31.25,17.08 C57.2 | 33.22,29.63 v33.3,29.44 33.18,29.57 U2.35 | C2.1 C1.1 26.02,18.41 25.34,18.41 23.95,19.81 v23.79,20.29 | U12.2 89.49,19.73 89.41,19.81 87.88,19.81 87.63,19.56 87.63,18.92 v87.62,18.91 | U2.47 31.91,24.69 32.71,25.49 v32.71,26.08 v32.7,26.09 | U5.1 76.37,27.09 76.2,26.92 74.89,26.92 Q5.2 | 19.3,17.02 C62.2 19.4,17.56 v19.41,17.58
  Top 0.305: C25.2 C22.2 | C20.1 75.66,9.41 C23.1 75.63,8.26 C27.1 75.64,7.16 C26.1 | C30.2 C31.2
  Top 0.406: C70.2 49.02,40.89 | U$4.2 53.34,43.69 53.34,43.43
  Bottom 0.203: U9.1 18.73,18.86 R14.2 19.37,17.62 v19.41,17.58 18.73,16.89 U9.18
  Bottom 0.254: R5.1 43.34,27.83 43.28,27.88 | U10.5 9.56,41.4 10.53,42.36 10.53,43.23 U10.9 | U6.4 78.61,45.61 79.1,46.09 80.4,46.09 U6.9 | U9.25 19.32,17.54 19.3,17.53
  other vias: 103.55,38.59 91.11,27.05 87.69,26.49 92.61,29.33 88.89,35.6 43.03,31.66 36.48,26.51 45.11,20.49 46.06,18.52 68.67,20.04 69.18,21.26 69.29,22.78 66.68,60.5 31.1,15.55 13.11,8.24 11.08,5.98 15.27,1.96 18.27,7.82 22.95,38.28 39.14,42.48 15.22,39.37 19.01,43.24 22.2,43.31 11.3,39.72 9.75,40.2 6.42,34.26 8.16,34.79 3.5,55.55 13.1,56.21 17.84,56.35 25.45,56.09 25.68,60.58 32.06,63.28 19.59,61.18 15.2,63.76 20.96,56.86 20.68,52.64 14.88,57.22 10.08,14.56 21.69,20.73 11.42,30.09 20.04,27.79 102.73,48.99 101.78,44.85 85.24,52.12 87.35,52.16 89.48,52.16 91.98,52.19 88.86,50.32 91.31,50.32 71.36,64.23 70.06,64.29 68.42,64.25 67.05,64.37 68.16,55.7 68.21,54.59 68.5,53.44 67.73,56.73 51.51,33.6 43.54,61.68 48.44,61.77 71.79,52.87 95.48,34.16 101.09,38.58 101.17,36.22 103.57,36.16 105.73,38.58 105.73,36.2 101.72,29.35 63.38,45.61 67.72,25.93 67.72,27.31 6.35,18.54 71.53,48.06 72.03,55.17 21.02,8.05 23.31,8.05 41.83,46.06 104.65,40.13 63.63,47.39 62.03,46.5 57.79,46.88 102.36,40.13
  pour Top (isolate 0.254): 0.93,0.94 108.64,1.18 108.1,53.43 105.55,53.43 103.44,53.44 102.14,53.4 97.79,53.47 88.7,53.46 77.6,53.38 77.64,59.36 75.56,59.36 75.5,65.34 0.69,65.13
  pour Bottom (isolate 0.254): 0.84,0.9 93.68,1.05 108.67,1.14 108.28,30.07 108.11,53.38 75.52,53.48 75.62,65.41 0.58,65.16 0.77,2.08
GPS_RX  (via drill 0.6)
  Top 0.61: U5.39 72.3,40.04 v71.12,38.86
  Bottom 0.61: R27.1 70.8,38.54 v71.12,38.86
GPS_STAT  (via drill 0.6)
  Top 0.305: U5.22 91.77,44.92 93.91,47.06 98.52,47.06 98.94,47.48 98.94,49.52 v98.93,49.53
  Bottom 0.305: v98.93,49.53 98.93,51.06 LED3.A
GPS_TX  (via drill 0.6)
  Top 0.61: U5.38 74.16,41.15 v71.12,41.15 | v64.01,39.88 R83.1 62.11,38.29 JP4.1
  Bottom 0.61: v64.01,39.88 68.33,39.88 69.85,41.15 v71.12,41.15
GPSL  (via drill 0.5)
  Top 0.254: U$4.3 53.49,45.06 52.58,45.97 49.53,45.97 47.5,43.94 v47.5,39.62 | U2.27 37.18,33.37 37.59,33.78 45.72,33.78 46.99,35.05 v46.99,36.32
  Bottom 0.254: v47.5,39.62 47.5,36.83 v46.99,36.32
GPSP  (via drill 0.5)
  Top 0.254: C70.1 48.89,42.74 U$4.5
  Top 0.61: v51.05,39.88 51.05,42.63 U$4.5
  Bottom 0.61: U$1.4 45.9,24.68 C59.1 | C59.1 C41.1 | C41.1 | C59.1 45.72,24.83 R29.2 44.59,26.53 44.45,26.67 44.45,30.99 46.23,32.77 49.02,32.77 50.8,34.54 50.8,39.62 v51.05,39.88 | C41.1 41.62,24.66 JP1.2
GSM_AI0  (via drill 0.6)
  Top 0.254: v44.84,14.9 67.71,14.9 v68.13,14.48
  Top 0.305: U5.9 85.17,28.88 83.69,27.41 83.69,18.29 v83.72,18.26
  Bottom 0.254: C19.1 19.82,13.31 20.86,14.35 32.44,14.35 33.01,14.92 | v68.13,14.48 68.3,14.48
  Bottom 0.305: v83.72,18.26 72.08,18.26 68.3,14.48 | 33.01,14.92 33.02,14.92 33.02,16.74 34.34,18.06 41.68,18.06 v44.84,14.9
  Bottom 0.406: R54.1 18.99,13.3 C19.1
GSM_ANT
  Top 0.305: U5.35 76.37,49.59 C52.1 R38.1
GSM_PWR  (via drill 0.6)
  Top 0.254: v71.73,22.91 72.26,22.91 72.47,23.11 73.48,23.11 R55.2 | v67.61,16.14 67,16.14 43.67,16.14 43.18,16.62 v43.18,18.46 v43.18,18.47 | U2.3 33.68,21.74 33.4,21.46 31.88,21.46 31.75,21.59 31.75,22.09 v31.65,22.19
  Bottom 0.254: v43.18,18.47 43.04,18.61 39.77,21.87 32.16,21.87 31.84,22.19 v31.65,22.19 | 71.72,22.9 v71.73,22.91
  Bottom 0.305: v67.61,16.14 67.7,16.14 71.63,20.07 71.63,22.8 v71.73,22.91
GSM_RX1  (via drill 0.6)
  Top 0.254: 81.96,36.5 v81.95,36.49 84.07,38.6 U5.28 | U2.30 35.68,32.23 36.22,32.77 36.22,34.78 36.86,35.43 44.2,35.43 v44.33,35.3
  Bottom 0.254: 72.95,45.23 67.84,45.23 67.56,44.96 67.56,42.93 66.29,41.66 46.76,41.66 45.21,40.11 45.21,35.81 44.7,35.3 v44.33,35.3 | 72.95,45.23 72.96,45.23 | 72.95,45.23 73.04,45.23 73.5,44.78 73.5,36.67 74.22,35.94 81.35,35.94 81.89,36.49 v81.95,36.49
GSM_STAT  (via drill 0.6)
  Top 0.305: U5.16 97.26,36.74 99.11,38.58 v99.11,45.4 v99.11,45.41
  Bottom 0.305: v99.11,45.41 99.11,46.92 LED2.A
GSM_TX1  (via drill 0.6)
  Top 0.254: U5.29 82.97,45.2 83.51,44.66 83.51,40.36 v80.06,36.91 | U2.31 35.18,32.46 35.74,33.02 35.74,35.74 36.4,36.4 44,36.4 v44.26,36.66
  Bottom 0.254: 72.28,45.87 67.46,45.87 67.06,45.47 67.06,43.18 66.04,42.16 46.07,42.16 44.26,40.35 v44.26,36.66 | 72.28,45.87 | 72.28,45.87 73.42,45.87 74.11,45.19 74.11,37.22 74.63,36.69 79.82,36.69 80.05,36.91 v80.06,36.91
GSML  (via drill 0.5)
  Top 0.254: U$3.5 54.36,53.09 54.1,53.34 50.04,53.34 49.28,52.58 49.28,50.55 46.48,47.75 46.48,39.12 v46.23,38.86 | U2.28 36.68,33.63 37.34,34.29 44.7,34.29 45.72,35.31 v45.97,35.31
  Bottom 0.254: v46.23,38.86 45.97,38.61 v45.97,35.31
GSMP  (via drill 0.5, 0.6)
  Top 0.254: 60.91,52.14 R86.1 | v77.47,38.61 77.47,36.32 78.23,35.56 83.82,35.56 87.38,39.12 v87.38,40.64
  Top 0.61: R57.1 R73.2 | R73.2 | R73.2 66.85,24.59 66.29,25.15 66.29,30.01 D18.A 66.75,30.23 66.75,32.77 | 66.42,32.94 D2.A 66.75,32.77 | 68.71,35.95 68.71,34.42 67.06,32.77 66.75,32.77 | C13.1 63.18,53.09 62.48,53.09 61.33,51.93 R86.1 60.95,51.94 60.35,51.94 60.16,52.14 U$3.1
  Top 0.813: JP2.2 63.25,55.88 65.02,54.1 C71.1
  Top 1.016: 68.71,35.95 C43.1 68.71,36.2 C44.1 68.73,38.17 C42.1 68.83,40.27 68.83,40.89 69.21,41.27 C51.+ 69.21,48.65 v68.33,49.53 68.33,50.8 66.11,53.02 C71.1 C13.1
  Bottom 0.254: LED1.A 99.15,41.75 98.81,41.4 88.14,41.4 v87.38,40.64 | v77.47,38.61 77.47,39.72 R71.2 77.49,39.86 76.2,41.15 76.2,45.97 72.64,49.53 v68.33,49.53
MIC1N  (via drill 0.6)
  Top 0.254: C29.2 75.63,4.2 75.69,4.14 76.89,4.14 76.96,4.06 76.96,3.35 C31.1
  Top 0.305: U5.4 79.67,12.03 v79.68,12.02 | v78.82,2.69 77.61,2.69 C30.1 C31.1 | C29.2 C28.2
  Bottom 0.305: v79.68,12.02 79.68,3.55 v78.82,2.69 79.37,2.14 85.42,2.14 86.67,3.39 J15.2
MIC1P  (via drill 0.6)
  Top 0.305: U5.3 78.57,15.12 | 78.57,15.12 | 78.57,15.12 v78.57,13.86 v78.56,13.85 | v78.45,8.07 78.45,8.09 78.3,8.24 C27.2 76.94,7.16 C26.2 C28.1 C29.1 76.97,4.91 79.3,4.91 81.72,2.48 88.13,2.48 89.21,3.56 J15.1
  Bottom 0.305: v78.56,13.85 78.56,8.18 v78.45,8.07
MISO_SF  (via drill 0.6)
  Top 0.61: v81.28,39.62 81.28,43.94 80.76,44.47 80.76,46.63 U5.31
  Bottom 0.61: U6.2 81.16,39.75 v81.28,39.62
MOSI_SF  (via drill 0.6)
  Top 0.61: U5.33 78.57,51.9 v78.55,51.91
  Bottom 0.61: v78.55,51.91 78.55,49.12 U6.5
MPU_INT  (via drill 0.6)
  Top 0.254: U2.39 30.07,28.69 v28.88,29.88
  Bottom 0.254: U9.12 21.95,15.54 22.15,15.34 24.27,15.34 24.5,15.57 24.5,17.09 24.77,17.37 27.13,17.37 27.38,17.61 27.38,19.77 28.48,20.88 | v28.88,29.88 28.88,29.86 30.26,28.48 30.26,21.54 29.7,20.98 28.59,20.98 28.48,20.88 | 28.48,20.89 28.48,20.88
N$1
  Top 0.254: U2.5 34.66,22.68 34.66,21.26 33.88,20.48 Q1.1 C1.2
N$2
  Top 0.254: U2.6 35.18,20.88 34.08,19.78 27.87,19.78 27.02,18.94 27.02,16.39 Q1.2 C2.2
N$3
  Top 0.61: C10.1 R2.1
N$4
  Top 0.406: R3.1 9.32,19.44 C11.1
N$5
  Top 0.254: U2.44 26,26.19 24.98,27.21 24.62,27.58 23.8,27.58 R6.1
N$6  (via drill 0.6)
  Top 0.254: U2.20 37.7,27.69
  Top 0.305: 37.7,27.69 v37.69,27.7
  Bottom 0.305: v37.69,27.7 42.02,27.7 R5.2
N$7  (via drill 0.6)
  Top 0.254: R7.2 47.33,54.93 v47.58,54.67
  Bottom 0.254: J5.D- 42.78,56.37 43.52,55.63 47.24,55.63 47.58,55.29 v47.58,54.67
N$8
  Top 0.61: U1.8 11.96,21.11 12.59,20.48 R1.2
N$9  (via drill 0.6)
  Top 0.254: R8.2 43.77,55.7 44.7,56.64 45.24,56.64 v45.3,56.59
  Top 0.305: R8.2 43.82,55.11
  Bottom 0.254: J5.D+ 43.58,57.24 44.23,56.59 v45.3,56.59
N$10
  Top 0.61: R10.1 U8.7
N$11
  Bottom 0.406: L1.1 41.31,56.88 41.97,57.53 41.97,58.99 J5.VBUS
N$12
  Top 0.61: 63.5,31.75 Q13.3 64.01,32.17 R37.2
N$14
  Top 0.61: U5.42 U5.43 74.17,35.81 73.91,36.07
  Top 1.016: D2.C 71.18,35.36 71.88,36.07 73.91,36.07
N$15  (via drill 0.7)
  Top 0.61: Q14.3 32.68,55.57 J14.1 | U4.3 40.36,56.16 v39.88,56.64
  Bottom 0.61: v39.88,56.64 37.85,56.64 36.07,58.42 33.19,58.42 32.68,57.91 32.68,55.57 J14.1
  Bottom 1.016: J14.1 32.47,51.33 JP3.2
N$16
  Top 0.61: D1.A 44.69,28.05 45.09,28.46 46.5,28.46 U8.8 49.3,28.45 50.08,29.23 50.08,34.35 R9.1
N$17  (via drill 1)
  Top 1.016: 31.31,49.17 L2.2
  Top 1.27: v23.24,45.95 23.24,51.43 24.13,52.32 30.23,52.32 31.24,51.31 31.24,49.14 L2.2
  Bottom 0.61: 13.93,45.6 13.88,45.6 U10.1
  Bottom 0.813: U10.1 14.28,45.21 14.54,45.42
  Bottom 1.016: C35.1 13.95,45.62 13.93,45.6 | 17.7,45.21 D9.C | D15.C
  Bottom 1.27: D15.C D9.C 16.34,45.22 16.09,45.42 14.54,45.42 | D15.C 22.5,45.22 v23.24,45.95
N$18
  Top 0.305: R28.2 74.39,59.62 J2.S
N$19
  Bottom 0.61: R19.2 Q6.B
N$20
  Bottom 0.61: R18.2 Q7.B
N$21
  Bottom 0.61: R17.2 Q3.B
N$22
  Bottom 0.61: R16.2 Q4.B
N$23  (via drill 0.6)
  Top 0.254: v23.85,17.8 22.6,17.8 22.2,18.2 20.69,18.2 R14.1
  Bottom 0.254: U9.9 v23.84,17.79 v23.85,17.8
N$24  (via drill 0.6)
  Top 0.254: v23.28,16.61 22.84,16.61 22.49,16.97 20.75,16.97 C62.1
  Bottom 0.254: U9.10 23.05,17.29 23.29,17.05 v23.29,16.62 v23.28,16.61
N$25
  Bottom 0.254: Q8.B
  Bottom 0.406: Q8.B 12.3,31.45 12.14,31.61 12.14,32.88 11.98,33.05 R39.2 R33.1
N$26
  Bottom 0.406: Q9.B 13.45,18.43 12.44,18.43 12.3,18.58 12.3,19.82 12.12,20 R40.2 R36.1
N$27
  Bottom 0.406: Q10.B 12.31,26.95 12.14,27.12 12.14,28.45 11.95,28.64 R41.2 11.19,28.65 R34.1
N$28
  Bottom 0.406: R35.1 R42.2 12.07,24.24 12.18,24.13 12.18,22.77 12.38,22.56 Q11.B
N$29
  Bottom 0.406: U7.1 30.85,2.28 C32.1
N$30
  Bottom 0.406: U7.3 28.31,3.17 C32.2
N$31
  Bottom 0.406: R29.1 46.85,27.83 47.5,27.18 48.62,27.18 U$1.5
N$32
  Bottom 0.61: U$1.1 59.83,17.16 62.23,19.56 62.23,35.81 62.34,35.93 R26.2 65.14,35.93 66.55,37.34 D3.A 66.49,37.96
N$33  (via drill 0.6)
  Top 0.254: v16.22,15.62 14.46,15.62 C60.1
  Bottom 0.254: U9.20 18,16.78 17.38,16.78 v16.22,15.62
N$34
  Top 0.61: U8.6 U8.5 | 48.79,35.35 R9.2 48.08,34.36 46.74,33.02 46.74,32.49 U8.5 | 48.79,35.35 48.79,36.71 R43.1 | U8.4 52.65,34.44 51.8,35.4 48.85,35.4 48.79,35.35 | U8.5
N$35
  Top 0.254: U4.1 42.09,53.41 R65.1
N$36
  Bottom 0.61: D3.C 69.28,33.47 69.6,33.78 R27.2
N$37
  Bottom 1.016: D8.C 33.36,45.17 34.08,45.89 35.89,45.89 R76.1
N$38  (via drill 0.6)
  Top 0.254: U2.7 35.68,20.41 34.4,19.12 30.19,19.12 C12.1 | C12.1 29.78,17.03 C57.1 | v28.68,18.7 C12.1
  Bottom 0.254: R67.2 29.85,18.78 C12.1 v28.69,18.71 v28.68,18.7
N$39  (via drill 0.6)
  Top 0.61: v59.69,35.05 59.58,34.94 R31.2 59.58,32.7 Q13.1
  Bottom 0.61: Q12.3 58.59,35.31 59.44,35.31 v59.69,35.05
N$40
  Top 0.305: Q5.1 R55.1 R56.1
N$41  (via drill 0.6)
  Top 0.813: v16,43.3 16,43.32 12.55,46.76 8.13,46.76 v7.46,47.42
  Bottom 0.813: U10.2 15.36,43.94 v16,43.3 | v7.46,47.42 7.46,48.99 R59.1
  Bottom 1.016: R60.1 7.49,49.02 R59.1
N$42
  Bottom 1.016: C34.2 18.75,37.27 R64.2
N$43
  Bottom 0.813: U10.6 R61.1
N$44
  Bottom 0.813: U10.4 13.48,39.56 12.21,38.3 12.21,37.13 R63.2
  Bottom 1.016: R62.2 R63.2
N$45
  Top 0.254: R30.1 38.72,52.56 U4.5
N$46
  Bottom 0.254: U$1.7 67.99,29.78 R84.1
N$48
  Bottom 0.61: U6.3 79.89,40.03 79.57,39.72 78.81,39.72 R71.1
N$49
  Bottom 0.813: U10.3 14.74,42.67 15.94,41.47 18.74,41.47 C34.1
  Bottom 1.016: C36.1 18.81,41.54 C34.1
N$51
  Bottom 0.61: U10.8 7.73,45.41 7.71,45.43
  Bottom 0.813: 7.71,45.43 7.71,45.86 8.98,47.12 11.5,47.12 11.99,47.62 11.99,49 C35.2
N$52
  Bottom 0.305: LED1.C 103.96,42.84 105.67,44.56 105.67,45.62 R25.1
N$55
  Bottom 0.305: LED3.C 104.25,51.07 105.69,49.63 105.69,48.28 R69.2
N$56
  Bottom 0.305: LED2.C R70.2
N$57  (via drill 0.6)
  Top 0.305: U5.8 84.07,29.72 v83.15,28.8 | R73.1 69.43,25.9 v69.43,27.42
  Bottom 0.305: v83.15,28.8 70.1,28.8 69.43,28.13 v69.43,27.42
N$58
  Top 0.305: R74.1 85.86,26.23 85.86,27.19 85.85,27.19 85.86,27.95 87.38,29.47 U5.11
N$59
  Top 0.61: U5.44 74.17,33.59 74.17,33.58 74.17,32 72.3,30.13 D18.C
N$60
  Top 0.305: R75.1 89.45,26.2 89.45,27.39 88.72,28.12 88.72,29.73 88.47,29.98 U5.12
N$61
  Top 0.305: U5.13 89.57,30.86 93.22,27.21 93.22,26.06 R72.1
N$62
  Bottom 1.016: R68.2 D17.C 9.08,51.44 R66.2 Q2.1
N$63
  Bottom 0.406: U7.2 29.58,6.68 29.84,6.93 32.32,6.93 C54.2
N$66  (via drill 0.6)
  Top 0.305: v105.65,17.05 105.65,20.16 SIM1.4
  Bottom 0.305: SIM2.C8 84.38,11.77 84.72,11.42 103.69,11.42 105.65,13.38 v105.65,17.05
N$67
  Top 0.254: U$3.2 60.82,53.09 R86.2 61.1,53.62 R87.1
N$68  (via drill 0.6)
  Top 0.305: v103.06,17.78 103.06,20.18 SIM1.2
  Bottom 0.305: SIM2.C6 94.24,19.22 95.27,20.25 102.44,20.25 103.12,19.56 103.12,17.84 v103.06,17.78 103.07,17.79
N$69
  Bottom 0.406: U7.4 27.04,3.23 27.57,2.7 C56.1
N$70
  Bottom 0.406: U7.5 25.77,2.62 C56.2
N$71
  Bottom 0.406: U7.6 24.5,2.12 C55.1
PWR_IND  (via drill 0.6)
  Top 0.305: v35.03,63.2 35.03,63.22 35.36,63.55 49.73,63.55 51.32,61.96 67.41,61.96 70.22,58.9 70.22,50.48 | 70.22,50.48 70.22,50.47 | v71.75,43.55 v71.75,43.56 70.22,45.09 70.22,50.48 | v77.2,34.8 v77.21,34.81 84.59,34.81 88.75,38.96 88.75,44.37 89.57,45.19 U5.23
  Bottom 0.305: R44.2 27.11,61.07 27.76,61.71 33.54,61.71 v35.03,63.2 | v71.75,43.55 72.88,42.42 72.88,37.06 72.89,37.05 72.89,35.7 73.79,34.8 v77.2,34.8
  Bottom 0.813: R44.2 15.33,53.98 Q2.3
PWR_KEY
  Top 0.305: R57.2 71.68,25.89 | 71.68,25.89 72.6,25.89 Q5.3 | U5.7 82.97,33.39 82.42,33.94 | 82.42,33.94 76.06,33.94 75.16,33.04 75.16,29.09 74.29,28.21 74.14,28.07 72.1,28.07 71.72,27.69 71.72,25.92 71.68,25.89 | 82.42,33.94 84.99,33.94 89.66,38.61 89.66,43.94 93.64,47.92 93.64,49.73 94.81,50.9 95.86,50.9 J8.4
RF_ANT
  Top 0.305: R38.2 76.38,53.86 C53.1 76.37,55.26 | 76.37,55.26 76.37,63.09 77.66,64.39 102.75,64.39 103.44,63.69 103.44,59.41 103.02,58.99 81.18,58.99 80.94,59.23 80.94,62.34 81.25,62.65 82.72,62.65 83.74,61.62 101.73,61.62 101.73,61.63 | R28.1 75.77,55.86 76.37,55.26
  pour Top: 76.15,60.1 78.97,60.1 78.97,63.54 102.65,63.54 102.65,59.81 81.65,59.81 81.65,62.31 82.15,62.31 82.15,60.31 102.15,60.31 102.15,63.11 80.15,63.11 80.15,58.11 104.15,58.11 104.15,65.11 76.14,65.11 76.14,60.1
RS232_RX2  (via drill 0.6)
  Top 0.254: U2.12 38.18,14.19 37.96,13.97 v37.96,12.83
  Bottom 0.254: U7.10 23.23,12.76 23.49,13.01 37.78,13.01 v37.96,12.83
RS232_TX2  (via drill 0.6)
  Top 0.254: U2.13 39.68,14.44 39.23,13.99 v39.1,13.99
  Bottom 0.254: U7.9 21.96,13.33 22.36,13.73 38.84,13.73 v39.1,13.99
RX3
  Top 0.254: U2.21 41.43,28.19 41.59,28.03 42.11,28.03 D1.C
RX_DEBUG
  Top 0.305: U5.18 93.4,38.94 93.73,39.27 93.73,45.08 94.52,45.87 95.81,45.87 J8.2
RXD
  Bottom 0.61: U7.7 23.23,3.51 22.86,3.15 21.54,3.15 20.8,2.4 J6.2
SCK_SF  (via drill 0.6)
  Top 0.61: U5.32 79.67,51.28 v79.89,51.5
  Bottom 0.61: v79.89,51.5 79.89,49.06 U6.6
SCL1  (via drill 0.6)
  Top 0.254: U2.42 29.23,27.19 28.57,27.85 27.19,27.85 26.72,28.32 26.3,28.32 v26.12,28.5 | v17.62,19.95 17.62,18 17.04,17.42 16.48,17.42 v16.45,17.51
  Top 0.406: R13.1 6.03,15.02 4.85,13.85 3.59,13.85 J4.1
  Bottom 0.254: U9.23 17.34,18.29 | v26.12,28.5 27.13,28.5 27.14,28.49 29.12,28.49 29.19,28.42 29.6,28.01 29.6,22.21 29.1,21.71 19.38,21.71 v17.62,19.95
  Bottom 0.305: J4.1 4.06,13.68 5.99,15.6 14.84,15.6 16.45,17.21 v16.45,17.51 | 17.34,18.29 v16.45,17.51 | 16.5,17.46 v16.45,17.51
SDA1  (via drill 0.6)
  Top 0.254: U2.43 28.02,26.69 27.56,27.16 v26.34,27.16 v26.33,27.15
  Top 0.406: R12.1 4.32,17.11 J4.2
  Bottom 0.254: v26.33,27.15 26.43,27.25 28.67,27.25 28.96,26.96 28.96,22.64 28.69,22.37 18.32,22.37 16.78,20.87 16.78,19.01 17.04,18.79 U9.24 16.92,18.79 16.91,18.8
  Bottom 0.305: 16.91,18.8 16.5,18.39 15.79,18.39 15.24,17.84 15.24,17.02 14.44,16.22 J4.2
SIM_CLK  (via drill 0.6)
  Top 0.305: R72.2 93.19,21.17 92.79,20.77 | 92.79,20.77 U12.4 91.22,21.84 v91.22,24.32 | C49.1 v93.2,17.56 | v93.21,20.17 93.21,20.34 92.79,20.77 | SIM1.6 104.34,27.53 v104.32,27.55
  Bottom 0.305: v93.2,17.56 93.2,20.16 v93.21,20.17 | v104.32,27.55 104.32,28.28 101.8,30.81 93.96,30.81 | 93.96,30.81 91.65,33.12 91.65,37.93 SIM2.C3 | 93.96,30.81 93.96,27.06 v91.22,24.32
SIM_DATA  (via drill 0.6)
  Top 0.305: 87.15,20.77 U12.6 88.81,20.79 88.81,21.3 88.5,21.61 v87.84,21.61 85.86,21.61 85.84,21.59 | v104.48,18.65 104.42,18.65 104.33,18.74 104.33,20.18 SIM1.3 | R74.2 85.84,21.59 | 85.84,21.59 85.84,15.42 C46.1
  Bottom 0.305: v104.48,18.65 104.47,18.66 104.47,20.79 103.79,21.46 92.3,21.46 91.7,20.86 SIM2.C7 91.7,20.4 91.07,21.03 88.43,21.03 v87.84,21.61
SIM_GND  (via drill 0.6)
  Top 0.305: U5.10 86.27,33.01 86.69,33.44 | 86.69,33.44 89.98,33.44 96.68,26.75 96.68,25.3 C47.2 98.89,25.23 101.02,23.1 103.44,23.1 SIM1.PAD | SIM1.PAD 101.8,21.05 SIM1.1 v101.8,18.57 | SIM1.5 105.61,24.86 SIM1.PAD | v86.58,34.11 86.58,33.55 86.69,33.44
  Bottom 0.305: SIM2.C5 100.86,14.54 101.81,15.49 101.81,18.56 v101.8,18.57 | SIM2.C4 84.38,36.32 v86.58,34.11
SIM_RST  (via drill 0.6)
  Top 0.305: 89.46,20.8 U12.5 89.49,22.12 v89.7,22.34 89.46,22.58 R75.2 | SIM1.7 v103.07,31.26 | v89.4,17 89.42,15.4 C48.1
  Bottom 0.305: v103.07,31.26 103.07,31.3 102.77,31.6 | 102.77,31.6 95.61,31.6 94.17,33.04 94.17,37.91 SIM2.C2 | v89.4,17 89.35,17.34 86.69,17.34 86.47,17.57 86.47,22.37 86.96,22.87 88.42,22.87 88.96,22.34 v89.7,22.34 89.88,22.51 104.36,22.51 105.77,23.92 105.77,30.02 104.19,31.6 102.77,31.6
SIM_VDD  (via drill 0.6)
  Top 0.305: U12.3 94.74,18.91 | C47.1 96.76,23.32 96.76,18.93 96.77,18.91 | SIM1.8 101.8,27.35 100.94,28.22 v100.83,28.22 100.83,28.74 100.38,29.2 100.38,32.45 v100.45,32.53 | v94.62,25.43 v94.62,25.42 94.62,19.03 94.74,18.91 | U5.14 91.77,34.46 v99.47,26.76 | C50.1 96.74,18.88 96.77,18.91 | v98.78,23.63 98.78,19.39 98.3,18.91 96.77,18.91 | 96.77,18.91 94.74,18.91
  Bottom 0.305: SIM2.C1 96.76,37.97 96.76,33.31 97.29,32.79 100.2,32.79 v100.45,32.53 | v94.62,25.43 94.62,26.44 96.42,28.24 100.82,28.24 v100.83,28.22 | v99.47,26.76 99.47,24.33 v98.78,23.63
SPK1N  (via drill 0.6)
  Top 0.305: U5.6 81.87,16.93 82.39,16.41 v82.47,16.41 | C21.2 C24.2 75.66,13.59 75.82,13.74 76.8,13.74 76.97,13.91 C22.1 C25.1 77,15.83 77,16.74 v76.99,16.76
  Bottom 0.305: v76.99,16.76 82.13,16.76 v82.47,16.41 82.11,16.04 82.11,7.46 81.59,6.95 J15.4
SPK1P
  Top 0.305: U5.5 80.77,10.85 80.14,10.23 79.98,10.23 | C21.1 C24.1 76.96,10.94 77.67,10.23 79.98,10.23 | C21.1 | C21.1 C20.2 76.96,9.41 C23.2 | 79.98,10.23 80.89,9.31 83.04,9.31 84.13,8.23 J15.3
SW
  Top 0.254: R58.2 29.59,10.88 29.87,11.16 40.62,11.16 41.4,11.94 41.4,25.4 40.61,26.19 U2.17
  Top 0.305: SW1.1 SW1.2
  Top 0.406: SW1.2 29.59,10.14 R58.2
SWCLK
  Top 0.254: U2.37 31.18,30.48 30.09,31.57 27.15,31.57 26.43,32.29 J10.2
SWO
  Top 0.254: U2.34 33.68,30.43 34.08,30.03 34.52,30.03 34.67,29.88 34.67,28.29 34.45,28.07 33.73,28.07 32.58,28.07 32.48,28.16 32.38,28.27 32.27,28.38 32.27,30.21 29.21,33.27 29.21,33.44 J10.3 29.06,33.68
T1  (via drill 0.5)
  Top 0.254: JP4.2 60.77,40.32 v60.45,40.64
  Bottom 0.254: R32.2 55.51,37.45 54.86,38.1 54.86,40.64 55.12,40.89 60.2,40.89 v60.45,40.64
  Bottom 0.61: U$1.2 51.89,19.63 52.83,20.57 52.83,25.65 55.88,28.7 R32.2 57.24,37.45 Q12.1
TX3
  Top 0.254: U2.22 41.53,28.69 R10.2
TX_DEBUG
  Top 0.305: U5.17 94.94,37.84 95.85,38.75 95.85,43.18 J8.1
TXD
  Bottom 0.61: U7.8 17.62,4.76 17.2,4.34 17.2,2.44 J6.1
USB_DN  (via drill 0.6)
  Top 0.254: U2.32 34.68,33.02 v34.86,33.47
  Top 0.305: v42.27,42.44 44.37,44.53 44.37,50.62 44.88,51.13 44.88,53.37 R7.1
  Bottom 0.305: v42.27,42.44 41.71,41.87 41.71,35.54 39.81,33.65 35.13,33.67 v34.86,33.47
USB_DP  (via drill 0.6)
  Top 0.254: v43.02,50.87 v43.02,50.88 | U2.33 34.18,32.86 v33.51,33.53
  Top 0.305: v41.27,43.47 43.02,45.22 v43.02,50.88 43.77,51.62 R8.1
  Bottom 0.254: R11.2 45.2,50.39 44.72,50.87 v43.02,50.87 v43.02,50.88
  Bottom 0.305: v41.27,43.47 41.02,43.22 41.02,35.86 39.48,34.33 34.3,34.33 34.3,34.32 v33.51,33.53
VBAT_EXT
  Top 0.813: MOV1.2 8.54,61.01 U11.4
  Bottom 1.016: MOV1.2 6.47,62.29 J3.1
VBAT_GND
  Top 0.813: MOV1.1 13.62,61.02 U11.3
  Bottom 1.016: MOV1.1 11.4,62.94 J3.2
VCC  (via drill 0.6)
  Top 0.254: C63.1 21.88,19.3 | 21.88,19.3 22.89,19.3 v23.22,18.97 | v35.23,15.85 35.92,15.85 36.68,16.62 36.68,22.58 | 25.36,22.13 25.36,22.01 24.6,21.24 23.14,21.24 22.8,20.9 22.8,19.96 21.88,19.3 | v17.95,14.66 17.98,15.93 17.36,16.55 15.8,16.55 14.86,17.56 | U2.24 40.77,29.69 v41.02,29.94 | 23.1,25.42 C9.1 21.36,25.42 v21.59,25.65
  Top 0.305: 32.59,24.01 32.4,24.19 U2.48 28.52,24.19 28.33,24.38 25.97,24.38 25.36,23.78 25.36,22.13 | 32.59,24.01 32.68,23.91 U2.1 | 32.59,24.01 33.24,24.66 v34.77,24.66 v34.77,24.67 35.78,24.67 36.32,24.13 36.68,23.77 U2.9 36.68,22.58 | U2.36 32.68,32.51 J10.4
  Top 0.406: R13.2 R12.2 14.42,17.11 14.86,17.56 15.87,18.56 15.87,20.37 16.48,20.98 20.23,20.98 20.7,20.5 C63.1 | R58.1 v32.94,10.13 v32.94,10.12 | U1.3 C9.1 | v59.18,39.88 59.18,40.89 v61.98,43.69
  Top 0.61: 23.1,25.42 C3.1 | R31.1 58.28,36.58 | 58.28,36.58 58.28,39.23 v59.18,39.88 | R37.1 R83.2 63.25,36.64 58.34,36.64 58.28,36.58
  Bottom 0.254: v23.22,18.97 23.22,18.49 23.02,18.29 U9.8 | R67.1 31.15,21.19 30.74,21.6 30.74,23.48 32.08,24.82 34.61,24.82 v34.77,24.66 | U9.13 21.23,14.95 21.12,14.84 20.38,14.84 19.9,14.36 18.25,14.36 v17.95,14.66 | D19.C 40.39,45.41 40.39,37.34 39.62,36.58 34.54,36.58 31.65,33.68 J10.4
  Bottom 0.305: 36.02,24.67 v34.77,24.67 v34.77,24.66 | v41.02,29.94 39.15,29.94 38.61,30.48 36.32,30.48 33.4,27.56 | R82.1 22.17,33.71 22.61,33.27 22.61,30.99 23.5,30.1 | 31.24,31.24 24.64,31.24 23.5,30.1 | 23.5,30.1 22.1,28.7 22.1,26.16 v21.59,25.65
  Bottom 0.406: 32.36,10.11 C54.1 32.37,8.21 C58.1 | 32.36,10.11 32.36,10.41 31.58,11.19 | v32.94,10.12 32.38,10.12 32.36,10.11 | R11.1 45.96,47.84 46.53,48.4 49.64,48.4 55.12,42.93 61.98,42.93 | 31.58,11.19 39.63,11.19 40.39,11.95 40.39,14.75 39.31,15.84 35.25,15.84 v35.23,15.85 | U6.7 81.16,49.5 81.42,49.77 86.23,49.77 86.59,49.4 86.59,41.45 86.08,40.93 83.75,40.93 82.97,40.16 82.97,38.53 82.64,38.2 79.42,38.2 78.73,37.51 75.25,37.51 74.88,37.88 74.88,45.66 73.55,46.99 67.31,46.99 66.41,46.09 66.41,43.43 65.9,42.93 61.98,42.93 | U7.16 31.3,10.91 31.58,11.19 | v61.98,43.69 61.98,42.93
  Bottom 0.61: 34.64,24.79 v34.77,24.66 | U6.7 81.16,49.63 81.35,49.82 82.2,49.82 82.35,49.68 82.35,49.13 U6.8 82.42,49.18 82.64,49.4 84.36,49.4 C45.1 | v34.77,24.66 34.54,24.89 34.54,26.42 33.4,27.56 31.24,29.72 31.24,31.24 31.24,33.41 J10.4 | R79.1 19.13,33.7 R80.1 20.41,33.69 R81.1 21.48,33.7 R82.1 | JP1.1 34.8,24.64 v34.77,24.66 | R32.1 55.88,39.37 56.36,39.85 59.16,39.85 v59.18,39.88 61.07,38.24 62.09,37.23 R26.1
  Bottom 1.016: C40.1 C4.1 | C4.1 37.87,45.97 R76.2 | C4.1 38.92,48.04 39.32,47.64 C5.1 | C5.1 39.92,45.87 D19.C | C5.1 41.34,47.64 C6.1 C7.1 C8.1 R11.1
VUSB  (via drill 0.6)
  Top 0.61: v47.42,51.33 v47.41,51.34 46.26,51.34 45.47,50.55 45.47,43.19 41.91,39.64 v38.84,39.64 v38.83,39.63
  Bottom 0.61: L1.2 46.59,53.18 47.45,52.57 47.41,52.52 v47.41,51.34 | R15.2 38.81,39.6 v38.83,39.63

## Text on the board
tPlace: 5V
tNames: FA_IOT v4.2.1 | - | + | 3.7V BAT | GND | 3V3 | D.I. | L | H | SDA | SCL | MIC1N | MIC1P | A.I. | SPK1N | SPK1P
bNames: 12V MAIN | FA_IOT v4.2.1 | + | - | + | + | GPS | + | GSM | PWR | 1-Wire | 232-TX | 232-RX